# Altium schematic sheet PCB_TX.SchDoc
size A3; SheetNumber: 1; SheetTotal: 1
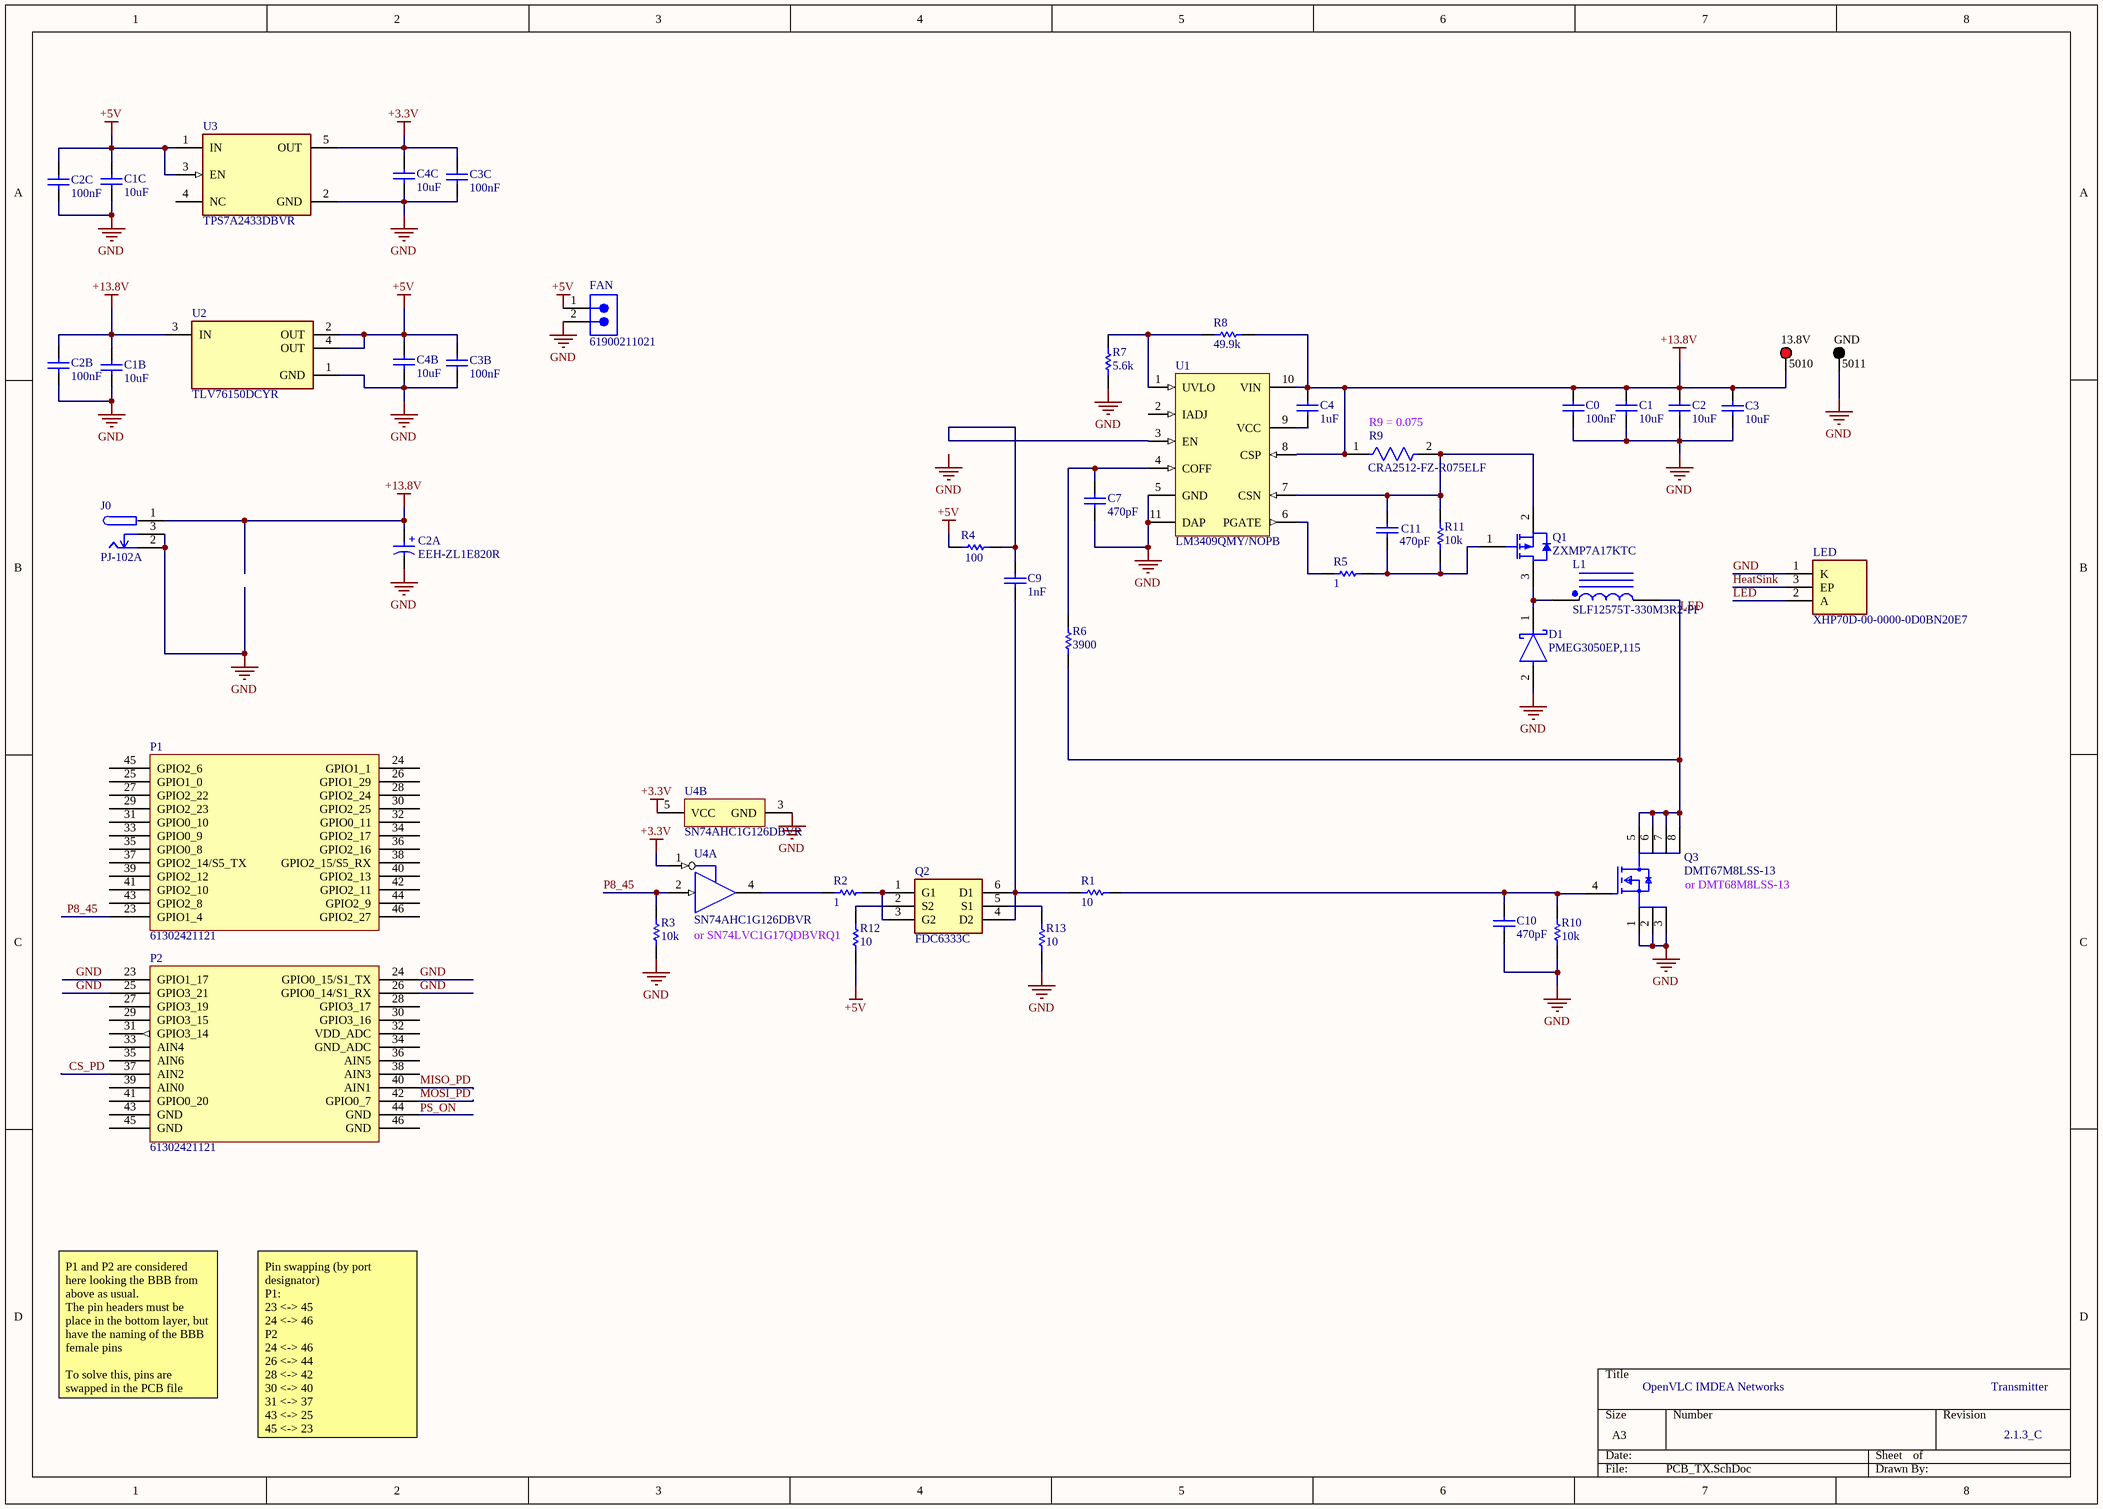
[diagram p0: PCB_TX.SchDoc]

## Parts
13.8V  5010  [KSTN-5010_V]
C0  value 100nF  [RESC1608X55N]  (hidden comment: GCM188R71H104KA57J)
C1  value 10uF  [RESC1608X55N]  (hidden comment: GRM188R6YA106MA73D)
C1B  value 10uF  [RESC1608X55N]  (hidden comment: GRM188R6YA475KE15D)
C1C  value 10uF  [RESC1608X55N]  (hidden comment: GRM188R6YA475KE15D)
C2  value 10uF  [RESC1608X55N]  (hidden comment: GRM188R6YA106MA73D)
C2A  EEH-ZL1E820R  [WCAP-PSLP_D5H5.5]
C2B  value 100nF  [RESC1608X55N]  (hidden comment: GRM188R6YA106MA73D)
C2C  value 100nF  [RESC1608X55N]  (hidden comment: GRM188R6YA106MA73D)
C3  value 10uF  [RESC1608X55N]  (hidden comment: GRM188R6YA106MA73D)
C3B  value 100nF  [RESC1608X55N]  (hidden comment: GCM188R71H104KA57J)
C3C  value 100nF  [RESC1608X55N]  (hidden comment: GCM188R71H104KA57J)
C4  value 1uF  [RESC1608X55N]  (hidden comment: GCM188D71H105KE36J)
C4B  value 10uF  [RESC1608X55N]  (hidden comment: GRM188R6YA106MA73D)
C4C  value 10uF  [RESC1608X55N]  (hidden comment: GRM188R6YA106MA73D)
C7  value 470pF  [RESC1608X55N]  (hidden comment: GCM1885C1H471JA16D)
C9  value 1nF  [RESC1608X55N]  (hidden comment: GRM1885C1H102JA01D)
C10  value 470pF  [RESC1608X55N]  (hidden comment: GCM1885C1H471JA16D)
C11  value 470pF  [RESC1608X55N]  (hidden comment: GCM1885C1H471JA16D)
D1  PMEG3050EP,115  [FP-SOD128-MFG]
FAN  61900211021  [61900211021]
GND  5011  [KSTN-5011_V]
J0  PJ-102A  [FP-PJ-102A-MFG]
L1  SLF12575T-330M3R2-PF  [EATN-DR125_V]
LED  XHP70D-00-0000-0D0BN20E7  [XHP70DH000000D0HN20E3_12]
P1  61302421121  [BBB_CAPE_NO_HEADER_R_24]
P2  61302421121  [BBB_CAPE_NO_HEADER_R_24]
Q1  ZXMP7A17KTC  [DIOD-TO252-3_V]
Q2  FDC6333C  [SOT95P275X110-6N]
Q3  DMT67M8LSS-13  [FP-751EB-MFG]
R1  value 10  [RESC1608X55N]  (hidden comment: RT0603BRD0710RL)
R2  value 1  [RESC1608X55N]  (hidden comment: RT0603BRD071RL)
R3  value 10k  [RESC1608X55N]  (hidden comment: RT0603BRD0710KL)
R4  value 100  [RESC1608X55N]  (hidden comment: RT0603BRD07100RL)
R5  value 1  [RESC1608X55N]  (hidden comment: RT0603BRD0710RL)
R6  value 3900  [RESC1608X55N]  (hidden comment: RT0603BRD073K9L)
R7  value 5.6k  [RESC1608X55N]  (hidden comment: RT0603BRD075K76L)
R8  value 49.9k  [RESC1608X55N]  (hidden comment: RT0603BRD0749K9L)
R9  CRA2512-FZ-R075ELF  [FP-CSRN2512-IPC_B]
R10  value 10k  [RESC1608X55N]  (hidden comment: RT0603BRD0710KL)
R11  value 10k  [RESC1608X55N]  (hidden comment: RT0603BRD0710KL)
R12  value 10  [RESC1608X55N]  (hidden comment: RT0603BRD0710RL)
R13  value 10  [RESC1608X55N]  (hidden comment: RT0603BRD0710RL)
U1  LM3409QMY/NOPB  [DGQ0010A_N]
U2  TLV76150DCYR  [FP-DCY0004A-MFG]
U3  TPS7A2433DBVR  [FP-DBV0005A-MFG]
U4  SN74AHC1G126DBVR  [DBV0005A_M]  (parts A,B of 2)

## Nets
+3.3V: C3C.1 C4C.2 U3.5(OUT) U4.1(OE) U4.5(VCC)
+5V: C1C.2 C2C.1 C3B.1 C4B.2 FAN.1 R4.2 R12.2 U2.2(OUT) U2.4(OUT) U3.1(IN) U3.3(EN)
+13.8V: 13.8V.1 C0.1 C1.1 C1B.2 C2.1 C2A.1(P) C2B.1 C3.1 C4.1 J0.1 R8.1 R9.1 U1.8(CSP) U1.10(VIN) U2.3(IN)
GND: C0.2 C1.2 C1B.1 C1C.1 C2.2 C2A.2(N) C2B.2 C2C.2 C3.2 C3B.2 C3C.2 C4B.1 C4C.1 C7.2 C10.2 D1.2(A) FAN.2 GND.1 J0.2 J0.3 LED.1(K) P2.23(GPIO1_17) P2.24(GPIO0_15/S1_TX) P2.25(GPIO3_21) P2.26(GPIO0_14/S1_RX) Q3.1(S) Q3.2(S) Q3.3(S) R3.2 R7.2 R10.2 R13.2 U1.5(GND) U1.11(DAP) U2.1(GND) U3.2(GND) U4.3(GND)
CS_PD: P2.37(AIN2)
HeatSink: LED.3(EP)
LED: L1.2 LED.2(A) Q3.5(D) Q3.6(D) Q3.7(D) Q3.8(D) R6.2
MISO_PD: P2.40(AIN1)
MOSI_PD: P2.42(GPIO0_7)
P8_45: P1.23(GPIO1_4) R3.1 U4.2(A)
NetC4_2: C4.2 U1.9(VCC)
NetC7_1: C7.1 R6.1 U1.4(COFF)
NetC9_1: C9.1 R4.1 U1.3(EN)
NetC9_2: C9.2 Q2.4(D2) Q2.6(D1) R1.2
NetC10_1: C10.1 Q3.4(G) R1.1 R10.1
NetC11_1: C11.1 Q1.2(SOURCE) R9.2 R11.1 U1.7(CSN)
NetC11_2: C11.2 Q1.1(GATE) R5.1 R11.2
NetD1_1: D1.1(C) L1.1 Q1.3(DRAIN)
NetQ2_1: Q2.1(G1) Q2.3(G2) R2.1
NetQ2_2: Q2.2(S2) R12.1
NetQ2_5: Q2.5(S1) R13.1
NetR2_2: R2.2 U4.4(Y)
NetR5_2: R5.2 U1.6(PGATE)
NetR7_1: R7.1 R8.2 U1.1(UVLO)

Not connected (* = marked no-connect by the designer): P1 24(GPIO1_1) 25(GPIO1_0) 26(GPIO1_29) 27(GPIO2_22) 28(GPIO2_24) 29(GPIO2_23) 30(GPIO2_25) 31(GPIO0_10) 32(GPIO0_11) 33(GPIO0_9) 34(GPIO2_17) 35(GPIO0_8) 36(GPIO2_16) 37(GPIO2_14/S5_TX) 38(GPIO2_15/S5_RX) 39(GPIO2_12) 40(GPIO2_13) 41(GPIO2_10) 42(GPIO2_11) 43(GPIO2_8) 44(GPIO2_9) 45(GPIO2_6) 46(GPIO2_27); P2 27(GPIO3_19) 28(GPIO3_17) 29(GPIO3_15) 30(GPIO3_16) 31(GPIO3_14) 32(VDD_ADC) 33(AIN4) 34(GND_ADC) 35(AIN6) 36(AIN5) 38(AIN3) 39(AIN0) 41(GPIO0_20) 43(GND) 44(GND) 45(GND) 46(GND); U1 2(IADJ); U3 4(NC)

## Notes on the sheet
- (near R9) R9 = 0.075
- (near Q3) or DMT68M8LSS-13
- or SN74LVC1G17QDBVRQ1
- P1 and P2 are considered here looking the BBB from above as usual.
  The pin headers must be place in the bottom layer, but have the naming of the BBB female pins
  To solve this, pins are swapped in the PCB file
- OpenVLC IMDEA Networks
- Transmitter
- Pin swapping (by port designator)
  P1:
  23 <-> 45
  24 <-> 46
  P2
  24 <-> 46
  26 <-> 44
  28 <-> 42
  30 <-> 40
  31 <-> 37
  43 <-> 25
  45 <-> 23
- 2.1.3_C
- Labels drawn without touching a wire or pin: GND, PS_ON
- (in symbol CMP-03913-53758736-1) +

## Library data of the parts
13.8V = CMP-1672-00002-4: Test Point, Red, Through Hole, RoHS, Bulk; Manufacturer: Keystone; Contact Material: Bronze; Mounting Technology: Through Hole; RoHSCompliant: true; Pins: 1; Package Quantity: 100; ComponentLink2Description: Datasheet; Height: 8.12 mm; ComponentLink1URL: http://www.keyelco.com/; DatasheetVersion: Rev. F, 12/2013; Mount: Through Hole; PackageReference: 5010; Contact Plating: Silver; Packaging: Bulk; Colour: Red; REACH SVHC: No SVHC; PackageDescription: 1-Pin Through Hole Device, Dia 3.17 mm; ComponentLink2URL: http://www.keyelco.com/product-pdf.cfm?p=1319; ComponentLink1Description: Manufacturer URL
C0 C1 C1B C1C C2 C2B C2C C3 C3B C3C C4 C4B C4C C7 C9-C11 = Cap: Capacitor; Published: 8-Jun-2000; LatestRevisionDate: 17-Jul-2002; LatestRevisionNote: Re-released for DXP Platform.; PackageReference: RAD-0.3; Publisher: Altium Limited; PackageDescription: Radial Cap, Thru-Hole; 2 Leads; 0.3 in Pin Spacing
C2A = CMP-03913-53758736-1: 875105242006 WCAP-PSLP Aluminum Polymer Capacitors; Voltage Rating (DC): 10V; Life (Hours): 2000hours; ESR (Equivalent Series Resistance): 30mΩ; Ripple Current: 1.97A; Leakage Current: 300µA; Capacitance: 47µF; Polarity: Polar; Pitch: 5.3mm; Tolerance: 20%; Diameter: 5mm; Length: 5.5mm; RoHS: Compliant; Packaging: Tape & Reel (TR); Case/Package: Radial; REACH SVHC: Unknown; Max Operating Temperature: 105°C; Min Operating Temperature: -55°C; Mount: Surface Mount; Voltage Rating: 10V; Height - Seated (Max): 5.5118mm; NexarPartId: 53758736
D1 = CMP-14398-000051-1: DIODE SCHOTTKY 30V 5A SOD128; RoHS Compliant: Yes
FAN = CMP-1502-00592-2: NexarPartId: 18818217; Gender: Male; Insulation Resistance: 1GΩ; Voltage Rating: 250V; Contact Resistance: 20mΩ; Connector Type: Male Pin; Number of Positions: 2; Insulation: Insulated; Current Rating: 3A; Pitch: 2.54mm; Contact Mating Length: 7.62mm; Packaging: Bulk; Contact Plating: Tin; REACH SVHC: Unknown; Height: 3.2mm; Lead Pitch: 2.54mm; Color: Beige; Flammability Rating: UL94 V-0; RoHS: Compliant; Operating Supply Voltage: 250V; Length: 5.08mm; Number of Pins: 2; Max Operating Temperature: 105°C; Number of Rows: 1; Min Operating Temperature: -40°C; Contact Material: Copper; Mount: Through Hole; Housing Material: Nylon; Width: 5.12mm; Fastening Type: Friction; Contact Gender: Male; Number of Contacts: 2; Termination: Through Hole
GND = CMP-1672-00003-4: Test Point, Black, Through Hole, RoHS, Bulk; Manufacturer: Keystone; ComponentLink2URL: http://www.keyelco.com/product-pdf.cfm?p=1320; Colour: Black; Pins: 1; REACH SVHC: No SVHC; ComponentLink1URL: http://www.keyelco.com/; PackageReference: 5011; Contact Plating: Silver; Package Quantity: 100; Packaging: Bulk; RoHSCompliant: true; Height: 8.12 mm; PackageDescription: 1-Pin Through Hole Device, Dia 3.17 mm; Mount: Through Hole; Mounting Technology: Through Hole; DatasheetVersion: Rev. F, 12/2013; ComponentLink1Description: Manufacturer URL; Contact Material: Bronze; ComponentLink2Description: Datasheet
J0 = CMP-12637-106234071-1: PJ-102A 2.0 x 6.5 mm, 2.5 A, Horizontal, Through Hole, Tapered Pins, Dc Power Jack Connector; Voltage Rating (DC): 24V; Number of Contacts: 3; Outside Diameter: 6.5mm; Gender: Male; Shielding: No; Insulation Resistance: 50MΩ; Current Rating: 2.5A; Inside Diameter: 2mm; Number of Conductors: 2; Housing Color: Black; RoHS: Compliant; Diameter: 2.1mm; Mount: Through Hole; Contact Plating: Nickel; NexarPartId: 106234071; Voltage Rating: 24V; Housing Material: Thermoplastic; Max Operating Temperature: 85°C; Color: Black; Contact Material: Copper, Nickel, Tin; Orientation: Horizontal; Packaging: Bulk; Flammability Rating: UL94 V-0; Schedule B: 8536695050, 8536695050; Contact Gender: Male; Lead Free: Lead Free; Termination: Through Hole; Min Operating Temperature: -25°C; Height: 11.2mm; Lifecycle Status: Production
L1 = CMP-2000-06178-1: High Power Density, High Efficiency, Shielded Inductor, 100 uH, 1.78 A, -40 to 125 degC, 2-Pin SMD, RoHS, Tape and Reel; Manufacturer: EATON; Tolerance (%): ±20%; Inductance-Nom: 100µH; Shielding: Yes; DC Resistance: 0.17O; Rated Current-Max: 1.78A; Datasheet URL: https://ciiva.com/datasheet-click-3083294?src=ciiva&sig=4634c5cd; Case Size/Dimension: 12.5x12.5x6mm; Package Description: 2-Pin Surface Mount Device, Body 12.5 x 12.5 mm; Datasheet Version: 04/2014; Package Reference: DR125; Manufacturer URL: http://www.eaton.com/; Mounting Technology: SurfaceMount
LED = XHP70D-H0-0000-0D0HN20E3: High Power LEDs - White White 5000 K 80-CRI, XLamp XHP70D; Manufacturer_Name: CREE LED; Geometry.Height: 4.62mm; Manufacturer_Part_Number: XHP70D-H0-0000-0D0HN20E3; Mouser Part Number: 941-XHP70DH0D0HN20E3; Mouser Price/Stock: https://www.mouser.co.uk/ProductDetail/Cree-LED/XHP70D-H0-0000-0D0HN20E3?qs=doiCPypUmgHnzoljhPHltw%3D%3D; Arrow Part Number: XHP70D-H0-0000-0D0HN20E3; Arrow Price/Stock: https://www.arrow.com/en/products/xhp70d-h0-0000-0d0hn20e3/cree-led?region=nac; Datasheet Link: https://www.mouser.in/datasheet/2/723/ds_XHP70_3-2399964.pdf
P1 = BBB_P8_reduced
P2 = BBB_P9_reduced
Q1 = CMP-1668-00001-5: P-Channel Enhancement Mode MOSFET, -100 V, -3.8 A, -55 to 150 degC, 3-Pin DPAK (TO252), RoHS, Tape and Reel; Manufacturer: Diodes Inc; DatasheetVersion: Rev. 2-2, 08/2014; Packaging: Tape and Reel; Min Operating Temperature: -55 degC; Package Quantity: 2500; Pins: 3; RoHSCompliant: true; ComponentLink1Description: Manufacturer URL; Mounting Technology: Surface Mount; Mount: Surface Mount; PackageDescription: 3-Pin Transistor Outline, Body 6.1 x 6.575 mm, Pitch 2.286 mm; ComponentLink1URL: http://www.diodes.com/; PackageReference: TO252-3; Length: 6.73 mm; Max Operating Temperature: 150 degC; ComponentLink2Description: Datasheet; Height: 2.39 mm; ComponentLink2URL: http://www.diodes.com/_files/datasheets/ZXMP10A18K.pdf; REACH SVHC: No SVHC
Q2 = FDC6333C: High performance trench technology for extremely low RDS(ON); Q2 2.0 A, 30V.; Low gate charge ; Q1 2.5 A, 30V; RDS(on) = 150 m @ VGS = 4.5 V; RDS(on) = 95 m@ VGS = 10 V; RDS(on) = 220 m @ VGS = -4.5 V; SuperSOT 6 package: small footprint (72% smaller thanSO-8); low profile (1mm thick).; RDS(on) = 150 m@ VGS = -10 V; Manufacturer_Name: onsemi; Geometry.Height: 1.1mm; Manufacturer_Part_Number: FDC6333C; Mouser Part Number: 512-FDC6333C; Mouser Price/Stock: https://www.mouser.co.uk/ProductDetail/onsemi-Fairchild/FDC6333C?qs=UMEuL5FsraAupx2e21YLSQ%3D%3D; Arrow Part Number: FDC6333C; Arrow Price/Stock: https://www.arrow.com/en/products/fdc6333c/on-semiconductor; Datasheet Link: https://www.onsemi.com/pub/Collateral/FDC6333C-D.PDF
Q3 = CMP-00278-87654981-1: FDS2672-F085 Trans MOSFET N-CH 200V 3.9A Automotive 8-Pin SOIC T/R; Manufacturer Lifecycle Status: LAST SHIPMENTS; Rds On Max: 70mΩ; Turn-On Delay Time: 22ns; Fall Time: 10ns; Max Power Dissipation: 1W; Turn-Off Delay Time: 35ns; Number of Channels: 1; Input Capacitance: 2.535nF; Max Junction Temperature (Tj): 150°C; Power Dissipation: 2.5W; Drain to Source Resistance: 59mΩ; Gate to Source Voltage (Vgs): 20V; Element Configuration: Single; Radiation Hardening: No; Drain to Source Voltage (Vdss): 200V; Number of Pins: 8; Case/Package: SOIC; Max Operating Temperature: 150°C; Height: 1.75mm; Lifecycle Status: EOL; Continuous Drain Current (ID): 3.9A; Weight: 230.4mg; RoHS: Compliant; Packaging: Cut Tape (CT); Min Operating Temperature: -55°C; Drain to Source Breakdown Voltage: 200V; Mount: Surface Mount; Rise Time: 10ns; NexarPartId: 87654981
R1-R8 R10-R13 = Res1: Resistor; Published: 8-Jun-2000; LatestRevisionDate: 17-Jul-2002; LatestRevisionNote: Re-released for DXP Platform.; PackageReference: AXIAL-0.3; Publisher: Altium Limited; PackageDescription: Axial Device, Thru-Hole; 2 Leads; 0.3 in Pin Spacing
R9 = CMP-26527-004947-1: Res Thick Film 2512 0.1Ω 1% 2W ±200ppm/°C Molded SMD Plastic T/R; Resistance: 100mR; Resistor Type: Thick Film; Contact Plating: Tin; Max Power Dissipation: 2W; Tolerance: 1%; Min Operating Temperature: -55°C; Case/Package: 2512; Radiation Hardening: No; Case Code (Imperial): 2512; Number of Terminations: 2; Series: CSRN; Width: 0.124inch; Power Rating: 2W; RoHS Compliant: Yes; Mount: Surface Mount; Temperature Coefficient: 200ppm/°C; Height: 0.028inch; Packaging: Tape and Reel; Case Code (Metric): 6432; Max Operating Temperature: 155°C; Length: 0.25inch
U1 = CMP-0063-01360-3: PFET Buck Controller for High Power LED Drives, 10-pin eMSOP, Pb-Free; Manufacturer: Texas Instruments; CompType: MiscPower; PackageTopMarking: ZXTT*SZDB; PowerWise: N; Code_JEDEC: MO-187-BAT; RoHS: Y; PackageReference: DGQ0010A; ComponentLink1Description: Datasheet URL; PackageDescription: Molded Mini-SO, Exposed Pad .118 x .118 x .034in Body, 10 Lead, .0197in Pitch; ComponentLink1URL: http://www.ti.com/general/docs/lit/getliterature.tsp?genericPartNumber=LM3409-Q1&fileType=pdf; PinCount: 10
U2 = CMP-00370-134324849-1: TLV76150DCYR 1-A 16-V high-PSRR linear voltage regulator 4-SOT-223 -40 to 125; Manufacturer Lifecycle Status: ACTIVE; Number of Channels: 1; Min Supply Voltage: 6.5V; Nominal Supply Current: 65µA; Dropout Voltage: 900mV; Accuracy: 1%; Max Supply Voltage: 16V; Max Junction Temperature (Tj): 125°C; Output Current: 1A; Output Voltage: 5V; Width: 3.5mm; Length: 6.5mm; NexarPartId: 134324849; Max Operating Temperature: 125°C; Thickness: 1.6mm; Min Operating Temperature: -40°C; Case/Package: SOT-223; Height: 1.8mm; Lifecycle Status: Production; Number of Pins: 4; Number of Outputs: 1
U3 = CMP-00370-106221451-1: TPS7A2433DBVR 200-mA, 18-V, ultra-low-IQ, low-dropout (LDO) voltage regulator with enable ; 5-SOT-23 -40 to 125; Manufacturer Lifecycle Status: ACTIVE; Number of Channels: 1; Output Voltage: 3.3V; Number of Pins: 5; NexarPartId: 106221451; Lifecycle Status: Production; Thickness: 1.2mm; Length: 2.9mm; Height: 1.45mm; Case/Package: SOT-23; Width: 1.6mm
U4 = CMP-0859-00139-3: Single Bus Buffer Gate With 3-State Outputs, DBV0005A, LARGE T&R; Manufacturer: Texas Instruments; Logic: True; tpd @ Nom Voltage(Max)(ns): 11.5,7.5; Technology Family: AHC; Bits(#): 1; VCC(Min)(V): 2; ICC @ Nom Voltage(Max)(mA): 0.01; Output Type: CMOS; Rating: Catalog; Sub-Family: Non-Inverting Buffer/Driver; VCC(Max)(V): 5.5; F @ Nom Voltage(Max)(Mhz): 75; 3-State Output: Yes; Output Drive (IOL/IOH)(Max)(mA): 50/-50; Voltage(Nom)(V): 3.3,5; Schmitt Trigger: No; Operating Temperature Range(C): -40 to 125,-40 to 85; Generic Part Number: SN74AHC1G126; PackageReference: DBV0005A; DatasheetVersion: SCLS379K; Input Type: CMOS